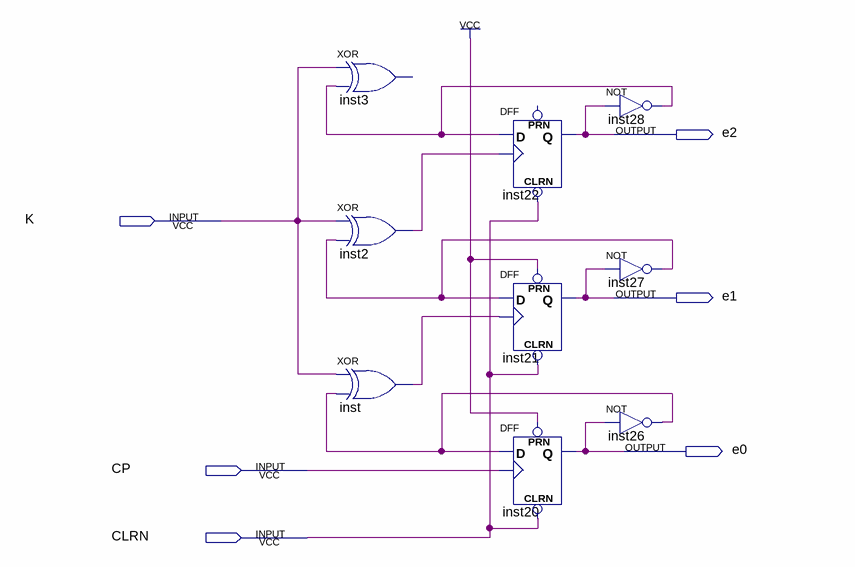
[diagram p0: schematic sheet]
// Quartus schematic counter.bdf as structural Verilog: 9 symbols, 6 pins
module counter (
  input  K,
  input  CP,
  input  CLRN,
  output e2,
  output e1,
  output e0
);

  wire inst2_out, inst26_out, inst27_out, inst28_out, inst_out;

  // XOR inst3 has open pins: IN1=K, IN2=inst28_out, OUT=open
  xor inst2 (inst2_out, K, inst27_out);
  xor inst (inst_out, K, inst26_out);
  DFF inst22 (.CLRN(CLRN), .CLK(inst2_out), .D(inst28_out), .Q(e2));  // open: PRN
  DFF inst21 (.CLRN(CLRN), .CLK(inst_out), .D(inst27_out), .PRN(1'b1), .Q(e1));
  DFF inst20 (.CLRN(CLRN), .CLK(CP), .D(inst26_out), .PRN(1'b1), .Q(e0));
  not inst28 (inst28_out, e2);
  not inst27 (inst27_out, e1);
  not inst26 (inst26_out, e0);
endmodule
